# Altium schematic sheet VoltageRegulator.SchDoc
size A4; SheetNumber: 2; SheetTotal: 2
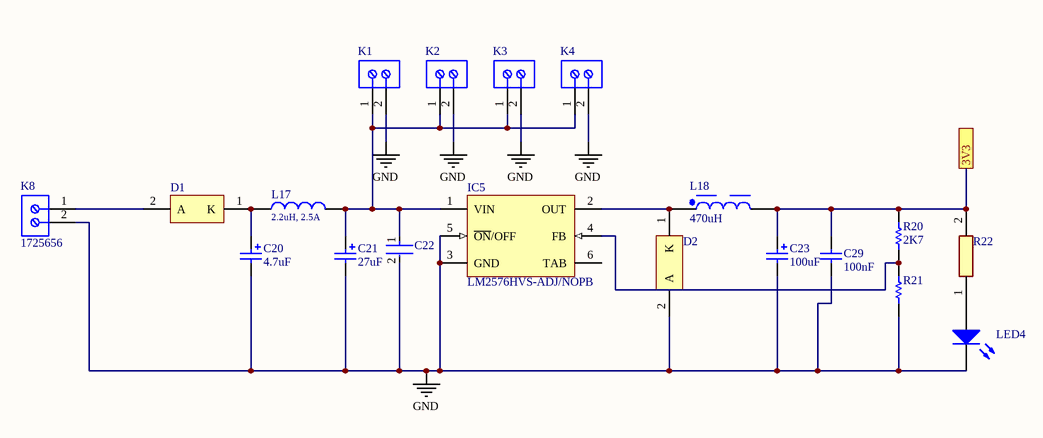
[diagram p0: VoltageRegulator.SchDoc]

## Parts
C20  4.7uF  [WCAP-PSLP_D6.3H7.7]
C21  27uF  [WCAP-ATUL_D8H11.5]
C22  (no value)  [FP-GRM32-MFG]
C23  100uF  [WCAP-PSLP_D5H5.5]
C29  100nF  [WCAP-CSGP_0805_H=1.25mm]
D1  (no value)  [ONSC-SMC-2-403-03_V]
D2  (no value)  [ONSC-SMC-2-403-03_V]
IC5  LM2576HVS-ADJ/NOPB  [KTT0005B_N]
K1  (no value)  [PHOE-1725656-2]
K2  (no value)  [PHOE-1725656-2]
K3  (no value)  [PHOE-1725656-2]
K4  (no value)  [PHOE-1725656-2]
K8  1725656  [PHOE-1725656-2]
L17  2.2uH, 2.5A  [WE-PD2_4532]
L18  470uH  [WE-PD_1050P]
LED4  (no value)  [Type 3mm]
R20  2K7  [RESC2013X70X40ML20T20]
R21  (no value)  [RESC2013X70X40NL20T20]
R22  (no value)  [RESC1608X55N]

## Ports
3V3

## Nets
GND: C20.2(N) C21.2(N) C22.2 C23.2(N) C29.1 D2.2(A) IC5.3(GND) IC5.5(~{ON}/OFF) K1.2 K2.2 K3.2 K4.2 K8.2 LED4.1(K) R21.1
3V3: C23.1(P) C29.2 L18.2 R20.2 R22.2 ; port 3V3
NetC20_1: C20.1(P) D1.1(K) L17.1
NetC21_1: C21.1(P) C22.1 IC5.1(VIN) K1.1 K2.1 K3.1 K4.1 L17.2
NetD1_2: D1.2(A) K8.1
NetD2_1: D2.1(K) IC5.2(OUT) L18.1
NetIC5_4: IC5.4(FB) R20.1 R21.2
NetLED4_2: LED4.2(A) R22.1

Not connected (* = marked no-connect by the designer): IC5 6(TAB)

## Library data of the parts
C20 = 875105945001: WCAP-PSLP Aluminum Polymer Capacitor, V-Chip, SMT, D6.3xH7.7mm, 4.7uF, 100V; Manufacturer: Wurth Elektronik; Ripple Current: 1060mA; Technical Reference: PSED0774R7M100DVCTCB000; Capacitance Tolerance: +/-20%; Dissipation Factor: 12%; Rated Voltage: 100VDC; Leakage Current: 600uA; ESR: 100mOhm; Endurance: 2000h; ComponentLink1URL: http://www.we-online.de; ComponentLink1Description: Manufacturer; Capacitance: 4.7uF; Diameter: 6.3mm; Published Date: October 2020; Packaging: Tape and Reel; Operating Temperature: -55 to +105degC; Mounting Technology: SMT; Manufacturer Part Number: 875105945001; Height: 7.7mm; ComponentLink2URL: https://www.we-online.com/catalog/datasheet/875105945001.pdf; ComponentLink2Description: Datasheet
C21 = 860040874001: WCAP-ATUL Aluminum Electrolytic Capacitor, Radial, THT, D8xH11.5mm, 27uF, 100V; Manufacturer: Wurth Elektronik; Ripple Current: 300mA; Technical Reference: ATDE115270M100DSPA7G000; Capacitance Tolerance: +/-20%; Rated Voltage: 100VDC; Leakage Current: 27uA; Endurance: 7000h; Dissipation Factor: 9%; Capacitance: 27uF; ComponentLink1URL: http://www.we-online.de; ComponentLink1Description: Manufacturer; Published Date: October 2020; Packaging: Ammo Pack; Operating Temperature: -40 to +105degC; Mounting Technology: THT; Manufacturer Part Number: 860040874001; Height: 11.5mm; Diameter: 8mm; ComponentLink2URL: https://www.we-online.com/catalog/datasheet/860040874001.pdf; ComponentLink2Description: Datasheet
C22 = CMP-1038-02162-3: CAP CER 4.7UF 50V X7R 1210; Manufacturer: Murata; Manufacturer Part Number: GRM32ER71H475KA88L; Tolerance: 10%; Temperature Coefficient: 15%; Material: Ceramic; Lead Free: Yes; Value: 4.7uF; ComponentLink2Description: Datasheet; Capacitance: 4.7uF; Digikey Description: CAP CER 4.7UF 50V X7R 1210; Category: Cap; Automotive: No; ComponentLink2URL: https://search.murata.co.jp/Ceramy/image/img/A01X/G101/ENG/GRM32ER71H475KA88-01A.pdf; Package: GRM32; Device Class L2: Capacitors; Voltage Rating: 50V; Device Class L1: Passive Components; Mouser Description: Capacitor Capacitance tolerance: ±10% Ceramic type: X7R Construction form: 1210 Capacitance: 4.7 µF Rated voltage: 50...; Octopart: https://octopart.com/grm32er71h475ka88l-murata-196576; Temperature: -55°C to +125°C; Temperature Range Low: -55°C; Height: 2.7mm; Temperature Characteristic: X7R; Temperature Range High: +125°C; RoHS: TRUE; Device Class L3: Ceramic Capacitors
C23 = 875105242010: WCAP-PSLP Aluminum Polymer Capacitor, V-Chip, SMT, D5xH5.5mm, 100uF, 10V; Manufacturer: Wurth Elektronik; Ripple Current: 1970mA; Technical Reference: PSEC055101M010DVCTBB000; Capacitance Tolerance: +/-20%; Dissipation Factor: 8%; Rated Voltage: 10VDC; Leakage Current: 300uA; ESR: 30mOhm; Endurance: 2000h; ComponentLink1URL: http://www.we-online.de; ComponentLink1Description: Manufacturer; Capacitance: 100uF; Diameter: 5mm; Published Date: October 2020; Packaging: Tape and Reel; Operating Temperature: -55 to +105degC; Mounting Technology: SMT; Manufacturer Part Number: 875105242010; Height: 5.5mm; ComponentLink2URL: https://www.we-online.com/catalog/datasheet/875105242010.pdf; ComponentLink2Description: Datasheet
C29 = 885012207128: WCAP-CSGP Multilayer Ceramic Chip Capacitor, General Purpose, size 0805, X7R, 100nF, 100V; Manufacturer: Wurth Elektronik; Rated Voltage: 100VDC; Isolation Resistance: >=1GOhm; Capacitance Tolerance: +/-10%; Technical Reference: X7R0805104K100DFCT10000; ComponentLink1Description: Manufacturer; ComponentLink1URL: http://www.we-online.de; ComponentLink2Description: Datasheet; ComponentLink2URL: https://www.we-online.com/catalog/datasheet/885012207128.pdf; Operating Temperature: -55 to +125degC; Packaging: Tape and Reel; Manufacturer Part Number: 885012207128; Published Date: May 2020; Ceramic Type: X7R; Dissipation Factor: =<2.5%; Height: 1.25mm; Mounting Technology: SMT; Size: 0805; Capacitance: 100nF
D1 D2 = CMP-1055-00390-1: Schottky Power Rectifier, 2-Pin SMC, Pb-Free, Tape and Reel; Manufacturer: On Semiconductor; PartNumber: MBRS540T3G; Configuration: Single; IFSM Max (A): 190; ComponentLink1URL: http://www.onsemi.com/; ComponentLink3URL: http://www.onsemi.com/pub_link/Collateral/403-03.PDF; ComponentLink1Description: Manufacturer URL; PackageVersion: Rev. E, 08/2005; Packing: Tape and Reel; ComponentLink2URL: http://www.onsemi.cn/pub_link/Collateral/MBRS540T3-D.PDF; RoHS: TRUE; DatasheetVersion: Rev. 8; Mounting Technology: Surface Mount; ComponentLink3Description: Package Specification; ComponentLink2Description: Datasheet; PackageDescription: 2-Pin Small Molded Package, J-Bend Lead, Body 5.845 x 6.855 mm; PackageReference: SMC-2-403-03
IC5 = CMP-0069-00134-3: SIMPLE SWITCHER® 3A Step-Down Voltage Regulator, 5-pin TO-263, Pb-Free; Manufacturer: Texas Instruments; PackageTopMarking: NSUZXYTTE#*LM2576*HVS-ADJ P+; PowerWise: N; Code_JEDEC: MO-169-AB; CompType: Switcher; PinCount: 5; ComponentLink1Description: Datasheet URL; ComponentLink1URL: http://www.ti.com/general/docs/lit/getliterature.tsp?genericPartNumber=LM2576HV&fileType=pdf; PackageDescription: TO-263, Molded, .400 x .390 x .180in, 5 Lead, .067in Pitch, Surface Mount; PackageReference: KTT0005B; RoHS: Y
K1-K4 = CMP-2000-05299-1: Male Header, Pitch 2.54 mm, 1 x 2 Position, Height 9 mm, Tail Length 3.5 mm; Manufacturer part No.: 1725656; Manufacturer: Phoenix Contact; Number of contacts: 2; Content: 250pc(s); Pitch: 2.54mm; Industrial packaging: Yes; Colour: Green; Type: MPT0,5/2-2,54; Datasheet URL: http://datasheet.octopart.com/1725656-Phoenix-Contact-datasheet-5302866.pdf; Manufacturer URL: http://www.phoenixcontact.com/; Datasheet Version: Apr-08
K8 = CMP-2000-05299-1: Male Header, Pitch 2.54 mm, 1 x 2 Position, Height 9 mm, Tail Length 3.5 mm; Manufacturer: Phoenix Contact; Number of contacts: 2; Content: 250pc(s); Pitch: 2.54mm; Industrial packaging: Yes; Colour: Green; Manufacturer part No.: 1725656; Type: MPT0,5/2-2,54; Datasheet URL: http://datasheet.octopart.com/1725656-Phoenix-Contact-datasheet-5302866.pdf; Manufacturer URL: http://www.phoenixcontact.com/; Datasheet Version: Apr-08
L17 = 744773022: WE-PD2 SMT Power Inductor, size 4532, 2.2uH, 2.5A; Manufacturer: Wurth Elektronik; Self Resonant Frequency: 85MHz; DC Resistance max.: 0.071Ohm; DC Resistance typ.: 0.034Ohm; Saturation Current: 3.38A; ComponentLink1Description: Manufacturer; ComponentLink1URL: http://www.we-online.de; ComponentLink2Description: Datasheet; ComponentLink2URL: https://www.we-online.com/catalog/datasheet/744773022.pdf; Packaging: Tape and Reel; Published Date: April 2020; Rated Current: 2.5A; Operating Temperature: -40 to +125degC; Size: 4532; Inductance: 2.2uH; Mounting Technology: SMT; Manufacturer Part Number: 744773022
L18 = 7447714471: WE-PD SMT Power Inductor, size 1050P, 470uH, 0.6A, 960mOhm; Manufacturer: Wurth Elektronik; Self Resonant Frequency: 2.5MHz; DC Resistance max.: 1100mOhm; Saturation Current: 0.82A; Type: Performance; ComponentLink1Description: Manufacturer; ComponentLink1URL: http://www.we-online.de; ComponentLink2Description: Datasheet; ComponentLink2URL: https://www.we-online.com/catalog/datasheet/7447714471.pdf; Mounting Technology: SMT; Operating Temperature: -40 to +150degC; Packaging: Tape and Reel; Published Date: August 2020; DC Resistance typ.: 960mOhm; Inductance: 470uH; Manufacturer Part Number: 7447714471; Rated Current: 0.6A; Size: 1050P
LED4 = CMP-1489-00002-1: THT LED round mono-color waterclear, WL-TMRW , Blue; Manufacturer: Wuerth Elektronik; PartNumber: 151033BS03000; ComponentLink2URL: http://katalog.we-online.de/pbs/datasheet/7448042001.pdfhttp://katalog.we-online.de/pbs/datasheet/7448042001.pdfhttp://katalog.we-online.de/pbs/datasheet/7448042001.pdfhttp://katalog.we-online.de/pbs/datasheet/151033BS03000.pdf; ComponentLink1Description: Manufacturer URL; Emitting color: Blue; PackageReference: Type 3mm; ComponentLink2Description: Datasheet; ComponentLink1URL: http://www.we-online.com
R20 = CMP-2001-00387-1: Part Number: ERJ-6GEYJ272V; Manufacturer: Panasonic
R21 = CMP-2001-00515-1: Manufacturer: Panasonic; Part Number: ERJ6ENF1601V
R22 = RC0603JR-071KL: Resistor; Manufacturer_Name: YAGEO (PHYCOMP); Datasheet Link: http://www.yageo.com/documents/recent/PYu-RC0603_51_RoHS_L_v5.pdf; Height: 0.55mm; Manufacturer_Part_Number: RC0603JR-071KL; Mouser Part Number: 603-RC0603JR-071KL; Mouser Price/Stock: https://www.mouser.co.uk/ProductDetail/Yageo/RC0603JR-071KL?qs=%2F9ZTgpVJnN7bctK4R%2FDEoA%3D%3D; Arrow Part Number: RC0603JR-071KL; Arrow Price/Stock: https://www.arrow.com/en/products/rc0603jr-071kl/yageo